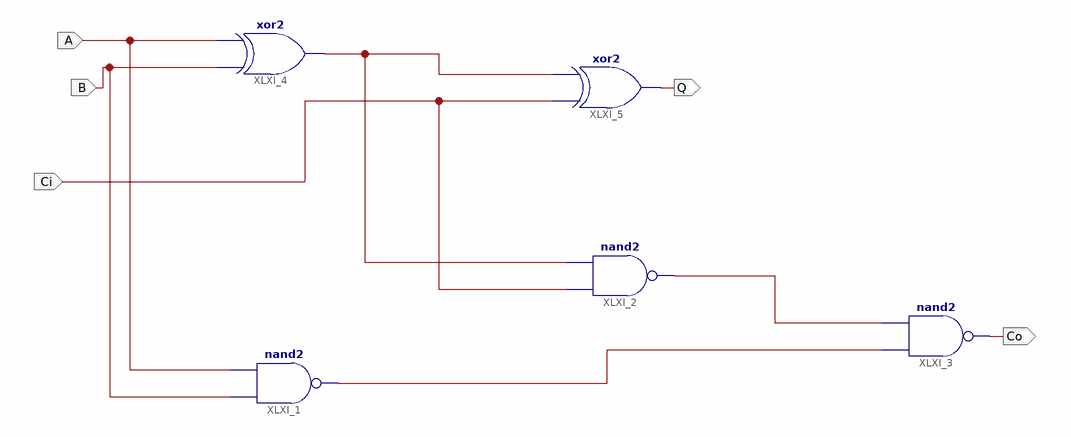
[diagram p0: schematic sheet 1]
// Xilinx ISE schematic FA.sch (spartan3e) as structural Verilog: 5 symbols, 5 ports
module FA (
  input  A,
  input  B,
  input  Ci,
  output Q,
  output Co
);

  wire XLXN_8, XLXN_10, XLXN_11;

  nand XLXI_1 (XLXN_11, B, A);
  nand XLXI_2 (XLXN_10, Ci, XLXN_8);
  nand XLXI_3 (Co, XLXN_11, XLXN_10);
  xor XLXI_4 (XLXN_8, B, A);
  xor XLXI_5 (Q, Ci, XLXN_8);
endmodule
